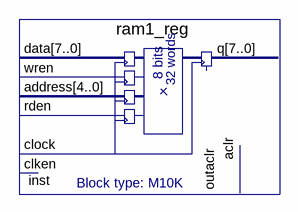
[diagram p0: schematic sheet]
// Quartus schematic testramclr.bdf as structural Verilog: 1 symbols, 0 pins
module testramclr (
);

  wire undriven;

  ram1_reg inst (.aclr(undriven), .outaclr(undriven));  // open: data, wren, address, rden, clock, clken, q
endmodule
